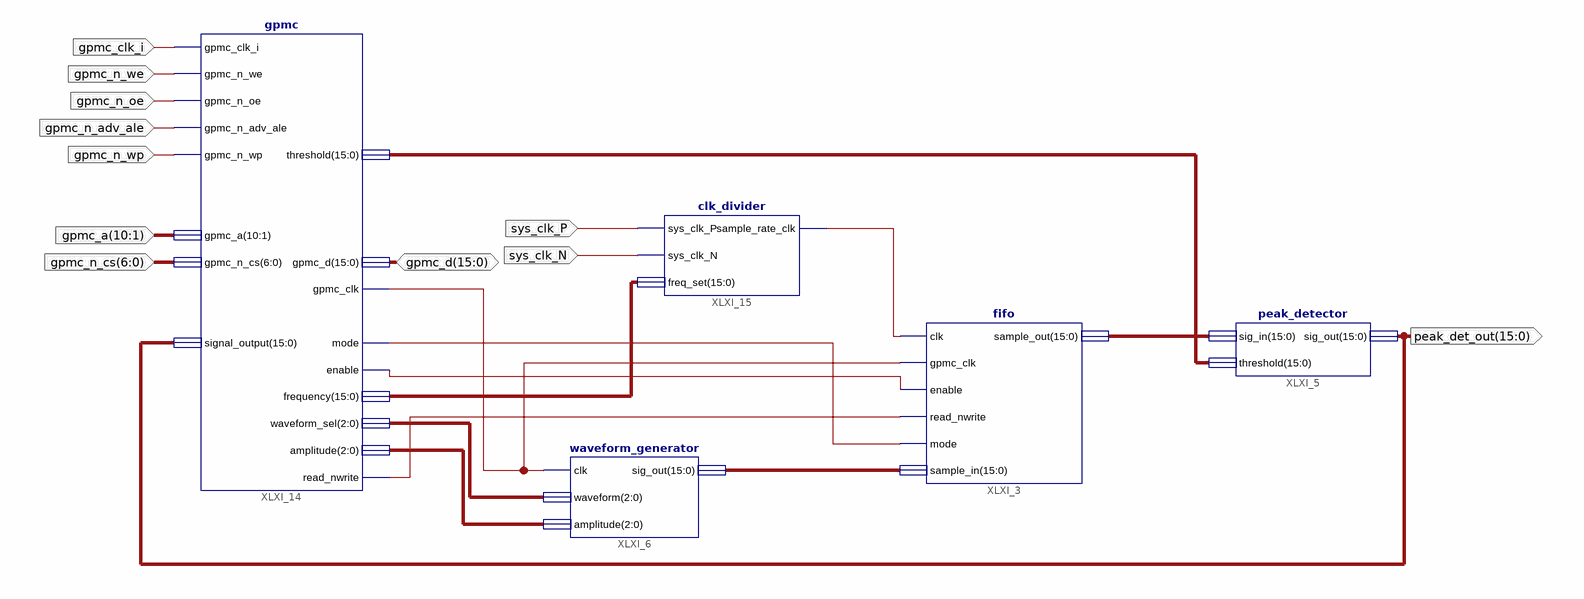
[diagram p0: schematic sheet 1]
// Xilinx ISE schematic sig_gen.sch (spartan6) as structural Verilog: 5 symbols, 11 ports
module sig_gen (
  input  sys_clk_P,
  input  sys_clk_N,
  input  gpmc_n_we,
  input  gpmc_n_oe,
  input  gpmc_n_adv_ale,
  input  gpmc_n_wp,
  input  [6:0] gpmc_n_cs,
  input  [10:1] gpmc_a,
  input  gpmc_clk_i,
  inout  [15:0] gpmc_d,
  output [15:0] peak_det_out
);

  wire enable, gpmc_clk, mode, read_nwrite, XLXN_36;
  wire [2:0] XLXN_58, XLXN_59;
  wire [15:0] threshold, XLXN_8, XLXN_24, XLXN_60;

  fifo XLXI_3 (
    .clk(XLXN_36), .gpmc_clk(gpmc_clk), .enable(enable), .read_nwrite(read_nwrite), .mode(mode),
    .sample_in(XLXN_8), .sample_out(XLXN_24));
  waveform_generator XLXI_6 (.clk(gpmc_clk), .waveform(XLXN_59), .amplitude(XLXN_58), .sig_out(XLXN_8));
  peak_detector XLXI_5 (.sig_in(XLXN_24), .threshold(threshold), .sig_out(peak_det_out));
  gpmc XLXI_14 (
    .gpmc_clk_i(gpmc_clk_i), .gpmc_n_we(gpmc_n_we), .gpmc_n_oe(gpmc_n_oe), .gpmc_n_adv_ale(gpmc_n_adv_ale),
    .gpmc_n_wp(gpmc_n_wp), .gpmc_a(gpmc_a), .gpmc_n_cs(gpmc_n_cs), .signal_output(peak_det_out),
    .gpmc_d(gpmc_d), .gpmc_clk(gpmc_clk), .mode(mode), .enable(enable), .read_nwrite(read_nwrite),
    .threshold(threshold), .frequency(XLXN_60), .waveform_sel(XLXN_59), .amplitude(XLXN_58));
  clk_divider XLXI_15 (.sys_clk_P(sys_clk_P), .sys_clk_N(sys_clk_N), .freq_set(XLXN_60), .sample_rate_clk(XLXN_36));
endmodule
